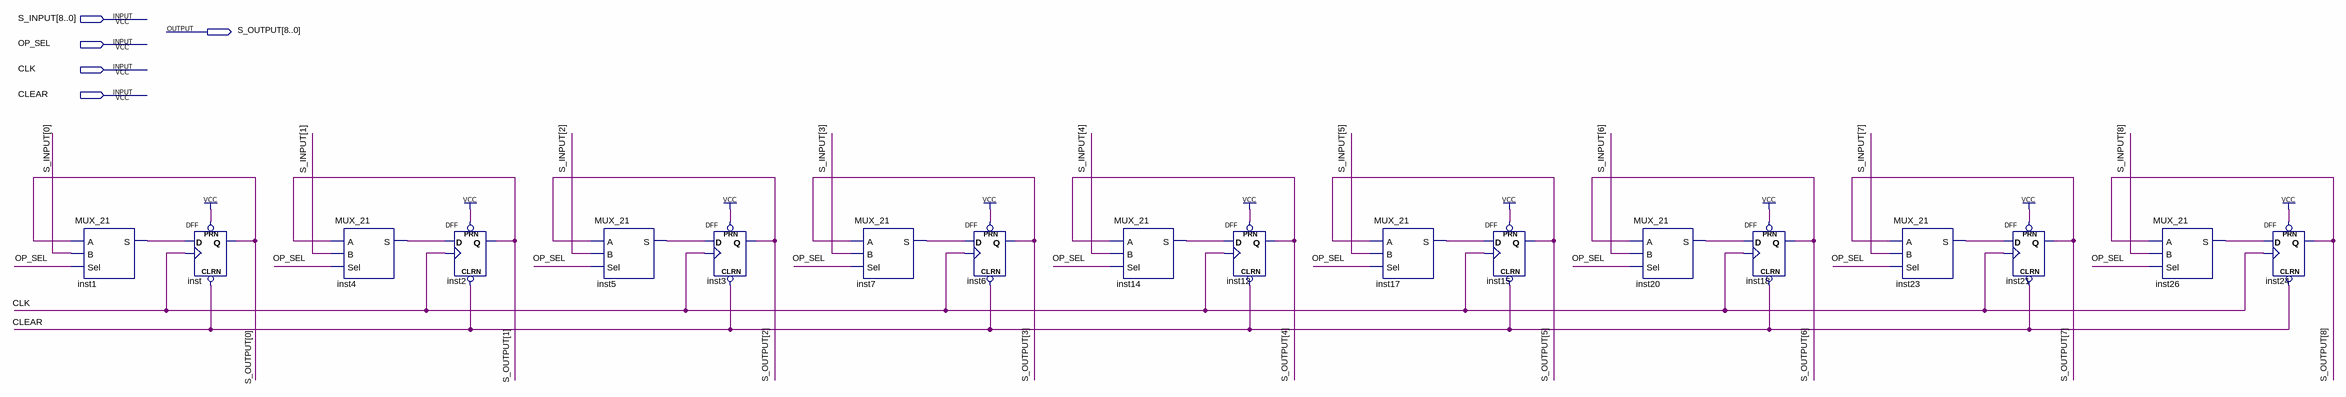
[diagram p0: schematic sheet]
// Quartus schematic STATE_REGISTER_OLD.bdf as structural Verilog: 18 symbols, 5 pins
module STATE_REGISTER_OLD (
  input  [8:0] S_INPUT,
  input  OP_SEL,
  input  CLK,
  input  CLEAR,
  output [8:0] S_OUTPUT
);

  wire inst1_s, inst4_s, inst5_s, inst7_s, inst14_s, inst17_s, inst20_s, inst23_s, inst26_s;

  MUX_21 inst1 (.A(S_OUTPUT[0]), .B(S_INPUT[0]), .Sel(OP_SEL), .S(inst1_s));
  DFF inst (.CLRN(CLEAR), .CLK(CLK), .D(inst1_s), .PRN(1'b1), .Q(S_OUTPUT[0]));
  MUX_21 inst4 (.A(S_OUTPUT[1]), .B(S_INPUT[1]), .Sel(OP_SEL), .S(inst4_s));
  DFF inst2 (.CLRN(CLEAR), .CLK(CLK), .D(inst4_s), .PRN(1'b1), .Q(S_OUTPUT[1]));
  MUX_21 inst5 (.A(S_OUTPUT[2]), .B(S_INPUT[2]), .Sel(OP_SEL), .S(inst5_s));
  DFF inst3 (.CLRN(CLEAR), .CLK(CLK), .D(inst5_s), .PRN(1'b1), .Q(S_OUTPUT[2]));
  MUX_21 inst7 (.A(S_OUTPUT[3]), .B(S_INPUT[3]), .Sel(OP_SEL), .S(inst7_s));
  DFF inst6 (.CLRN(CLEAR), .CLK(CLK), .D(inst7_s), .PRN(1'b1), .Q(S_OUTPUT[3]));
  MUX_21 inst14 (.A(S_OUTPUT[4]), .B(S_INPUT[4]), .Sel(OP_SEL), .S(inst14_s));
  DFF inst12 (.CLRN(CLEAR), .CLK(CLK), .D(inst14_s), .PRN(1'b1), .Q(S_OUTPUT[4]));
  MUX_21 inst17 (.A(S_OUTPUT[5]), .B(S_INPUT[5]), .Sel(OP_SEL), .S(inst17_s));
  DFF inst15 (.CLRN(CLEAR), .CLK(CLK), .D(inst17_s), .PRN(1'b1), .Q(S_OUTPUT[5]));
  MUX_21 inst20 (.A(S_OUTPUT[6]), .B(S_INPUT[6]), .Sel(OP_SEL), .S(inst20_s));
  DFF inst18 (.CLRN(CLEAR), .CLK(CLK), .D(inst20_s), .PRN(1'b1), .Q(S_OUTPUT[6]));
  MUX_21 inst23 (.A(S_OUTPUT[7]), .B(S_INPUT[7]), .Sel(OP_SEL), .S(inst23_s));
  DFF inst21 (.CLRN(CLEAR), .CLK(CLK), .D(inst23_s), .PRN(1'b1), .Q(S_OUTPUT[7]));
  MUX_21 inst26 (.A(S_OUTPUT[8]), .B(S_INPUT[8]), .Sel(OP_SEL), .S(inst26_s));
  DFF inst24 (.CLRN(CLEAR), .CLK(CLK), .D(inst26_s), .PRN(1'b1), .Q(S_OUTPUT[8]));
endmodule
